# Altium schematic sheet UI_Sch.SchDoc
size A
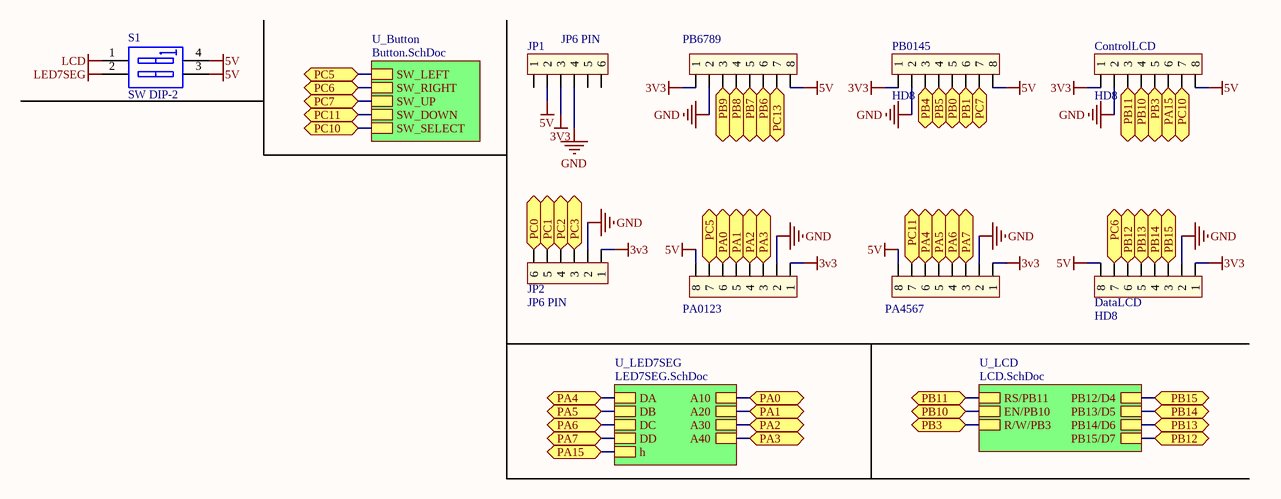
[diagram p0: UI_Sch.SchDoc]

## Parts
ControlLCD  HD8  [HED8]
DataLCD  HD8  [HED8]
JP1  JP6 PIN  [JP6]
JP2  JP6 PIN  [JP6]
PA0123  (no value)  [HED8]
PA4567  (no value)  [HED8]
PB0145  HD8  [HED8]
PB6789  (no value)  [HED8]
S1  SW DIP-2  [DIP-4]

## Sub-sheets
U_Button = Button.SchDoc: SW_LEFT, SW_RIGHT, SW_UP, SW_DOWN, SW_SELECT
U_LCD = LCD.SchDoc: RS/PB11, EN/PB10, R/W/PB3, PB12/D4, PB13/D5, PB14/D6, PB15/D7
U_LED7SEG = LED7SEG.SchDoc: h, A10, A20, A30, A40, DA, DB, DC, DD

## Ports
PA0, PA1, PA2, PA3, PA4, PA5, PA6, PA7, PA15, PB0, PB1, PB3, PB4, PB5, PB6, PB7, PB8, PB9, PB10, PB11, PB12, PB13, PB14, PB15, PC0, PC1, PC2, PC3, PC5, PC6, PC7, PC10, PC11, PC13

## Nets
3V3: ControlLCD.1 DataLCD.1 JP1.3 JP2.1 PA0123.1 PA4567.1 PB0145.1 PB6789.1
5V: ControlLCD.8 DataLCD.8 JP1.2 PA0123.8 PA4567.8 PB0145.8 PB6789.8 S1.3(B2) S1.4(B1)
GND: ControlLCD.2 DataLCD.2 JP1.4 JP2.2 PA0123.2 PA4567.2 PB0145.2 PB6789.2
LCD: S1.1(A1)
LED7SEG: S1.2(A2)
PA0: PA0123.6 ; port PA0, sheet U_LED7SEG/A10
PA1: PA0123.5 ; port PA1, sheet U_LED7SEG/A20
PA2: PA0123.4 ; port PA2, sheet U_LED7SEG/A30
PA3: PA0123.3 ; port PA3, sheet U_LED7SEG/A40
PA4: PA4567.6 ; port PA4, sheet U_LED7SEG/DA
PA5: PA4567.5 ; port PA5, sheet U_LED7SEG/DB
PA6: PA4567.4 ; port PA6, sheet U_LED7SEG/DC
PA7: PA4567.3 ; port PA7, sheet U_LED7SEG/DD
PA15: ControlLCD.6 ; port PA15, sheet U_LED7SEG/h
PB0: PB0145.5 ; port PB0
PB1: PB0145.6 ; port PB1
PB3: ControlLCD.5 ; port PB3, sheet U_LCD/R/W/PB3
PB4: PB0145.3 ; port PB4
PB5: PB0145.4 ; port PB5
PB6: PB6789.6 ; port PB6
PB7: PB6789.5 ; port PB7
PB8: PB6789.4 ; port PB8
PB9: PB6789.3 ; port PB9
PB10: ControlLCD.4 ; port PB10, sheet U_LCD/EN/PB10
PB11: ControlLCD.3 ; port PB11, sheet U_LCD/RS/PB11
PB12: DataLCD.6 ; port PB12, sheet U_LCD/PB15/D7
PB13: DataLCD.5 ; port PB13, sheet U_LCD/PB14/D6
PB14: DataLCD.4 ; port PB14, sheet U_LCD/PB13/D5
PB15: DataLCD.3 ; port PB15, sheet U_LCD/PB12/D4
PC0: JP2.6 ; port PC0
PC1: JP2.5 ; port PC1
PC2: JP2.4 ; port PC2
PC3: JP2.3 ; port PC3
PC5: PA0123.7 ; port PC5, sheet U_Button/SW_LEFT
PC6: DataLCD.7 ; port PC6, sheet U_Button/SW_RIGHT
PC7: PB0145.7 ; port PC7, sheet U_Button/SW_UP
PC10: ControlLCD.7 ; port PC10, sheet U_Button/SW_SELECT
PC11: PA4567.7 ; port PC11, sheet U_Button/SW_DOWN
PC13: PB6789.7 ; port PC13

Not connected (* = marked no-connect by the designer): JP1 1 5 6

## Library data of the parts
ControlLCD DataLCD PA0123 PA4567 PB0145 PB6789 = Hed8: Hedear 8; Creat by: VanDungEvn@Gmail.com
JP1 JP2 = JP6: Value: JP7
S1 = SW DIP-2: DIP Switch, 2 Position, SPST; Published: 24-Mar-1999; LatestRevisionDate: 17-Jul-2002; LatestRevisionNote: Re-released for DXP Platform.; PackageReference: DIP-4; Publisher: Altium Limited